# Altium schematic sheet PIC24.SchDoc
size A
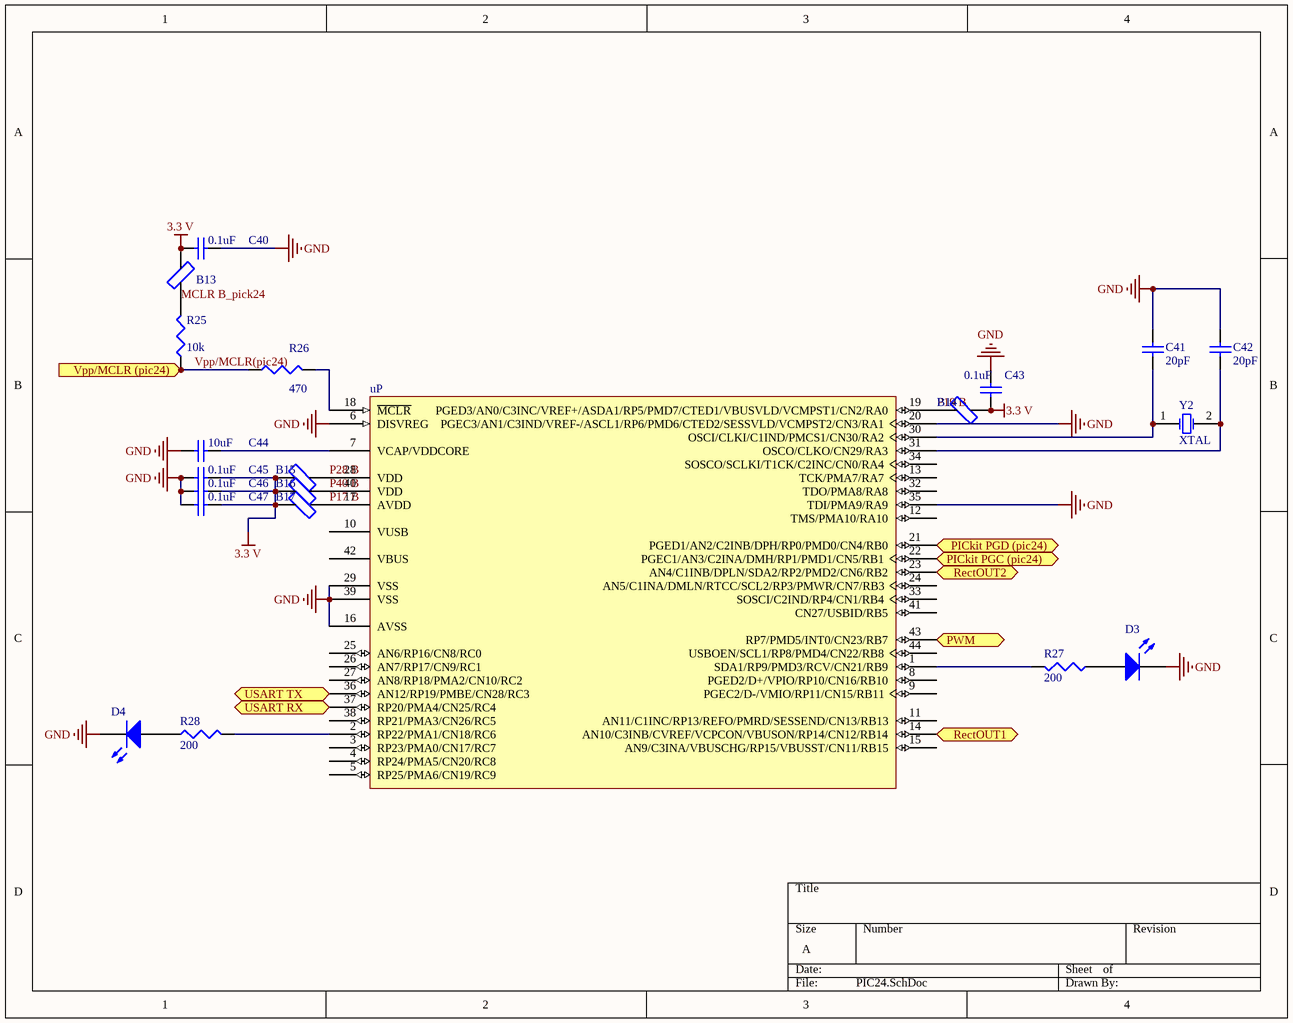
[diagram p0: PIC24.SchDoc]

## Parts
B13  Ferrite Bead  [Resistor 0603]  (value not drawn)
B14  Ferrite Bead  [Resistor 0603]  (value not drawn)
B15  Ferrite Bead  [Resistor 0603]  (value not drawn)
B16  Ferrite Bead  [Resistor 0603]  (value not drawn)
B17  Ferrite Bead  [Resistor 0603]  (value not drawn)
C40  value 0.1uF  [C1206]  (hidden comment: 0.1uF 20V Ceramic Low ESR)
C41  20pF  [Capacitor 0603]
C42  20pF  [Capacitor 0603]
C43  value 0.1uF  [C1206]  (hidden comment: 0.1uF 20V Ceramic Low ESR)
C44  value 10uF  [Capacitor 0603]  (hidden comment: 10uF 6.3V Ceramic or Tantalum Low ESR ~5 Ohm)
C45  value 0.1uF  [C1206]  (hidden comment: 0.1uF 20V Ceramic Low ESR)
C46  value 0.1uF  [C1206]  (hidden comment: 0.1uF 20V Ceramic Low ESR)
C47  value 0.1uF  [C1206]  (hidden comment: 0.1uF 20V Ceramic Low ESR)
D3  LED2  [Resistor 0603]  (value not drawn)
D4  LED2  [Resistor 0603]  (value not drawn)
R25  value 10k  [Capacitor 0603]  (hidden comment: 1/16 w 10K ohms 1%)
R26  470  [Capacitor 0603]
R27  value 200  [Capacitor 0603]  (hidden comment: 200 ohms 1%)
R28  value 200  [Capacitor 0603]  (hidden comment: 200 ohms 1%)
uP  PIC24FJ32GB004-I/PT  [TQFP-PT44_L]  (value not drawn)
Y2  XTAL  [SMD Oscillator]

## Ports
PICkit PGC (pic24) (in), PICkit PGD (pic24) (in), PWM (out), RectOUT1 (in), RectOUT2 (in), USART RX (in), USART TX (out), Vpp/MCLR (pic24) (in)

## Nets
3.3 V: B13.2 B14.2 B15.1 B16.1 B17.1 C40.2 C43.2 C45.1 C46.1 C47.1
GND: C40.1 C41.1 C42.1 C43.1 C44.2 C45.2 C46.2 C47.2 D3.2(K) D4.2(K) uP.6(DISVREG) uP.16(AVSS) uP.20(PGEC3/AN1/C3IND/VREF-/ASCL1/RP6/PMD6/CTED2/SESSVLD/VCMPST2/CN3/RA1) uP.29(VSS) uP.35(TDI/PMA9/RA9) uP.39(VSS)
MCLR B_pick24: B13.1 R25.2
P17 B: B17.2 uP.17(AVDD)
P19 B: B14.1 uP.19(PGED3/AN0/C3INC/VREF+/ASDA1/RP5/PMD7/CTED1/VBUSVLD/VCMPST1/CN2/RA0)
P28 B: B15.2 uP.28(VDD)
P40 B: B16.2 uP.40(VDD)
PICkit PGC (pic24): uP.22(PGEC1/AN3/C2INA/DMH/RP1/PMD1/CN5/RB1) ; port PICkit PGC (pic24)
PICkit PGD (pic24): uP.21(PGED1/AN2/C2INB/DPH/RP0/PMD0/CN4/RB0) ; port PICkit PGD (pic24)
PWM: uP.43(RP7/PMD5/INT0/CN23/RB7) ; port PWM
RectOUT1: uP.14(AN10/C3INB/CVREF/VCPCON/VBUSON/RP14/CN12/RB14) ; port RectOUT1
RectOUT2: uP.23(AN4/C1INB/DPLN/SDA2/RP2/PMD2/CN6/RB2) ; port RectOUT2
USART RX: uP.37(RP20/PMA4/CN25/RC4) ; port USART RX
USART TX: uP.36(AN12/RP19/PMBE/CN28/RC3) ; port USART TX
Vpp/MCLR(pic24): R25.1 R26.1 ; port Vpp/MCLR (pic24)
NetC41_2: C41.2 uP.30(OSCI/CLKI/C1IND/PMCS1/CN30/RA2) Y2.1(OSC1)
NetC42_2: C42.2 uP.31(OSCO/CLKO/CN29/RA3) Y2.2(OSC2)
NetC44_1: C44.1 uP.7(VCAP/VDDCORE)
NetD3_1: D3.1(A) R27.1
NetD4_1: D4.1(A) R28.1
NetR26_2: R26.2 uP.18(~{MCLR})
NetR27_2: R27.2 uP.1(SDA1/RP9/PMD3/RCV/CN21/RB9)
NetR28_2: R28.2 uP.2(RP22/PMA1/CN18/RC6)

Not connected (* = marked no-connect by the designer): uP 3(RP23/PMA0/CN17/RC7) 4(RP24/PMA5/CN20/RC8) 5(RP25/PMA6/CN19/RC9) 8(PGED2/D+/VPIO/RP10/CN16/RB10) 9(PGEC2/D-/VMIO/RP11/CN15/RB11) 10(VUSB) 11(AN11/C1INC/RP13/REFO/PMRD/SESSEND/CN13/RB13) 12(TMS/PMA10/RA10) 13(TCK/PMA7/RA7) 15(AN9/C3INA/VBUSCHG/RP15/VBUSST/CN11/RB15) 24(AN5/C1INA/DMLN/RTCC/SCL2/RP3/PMWR/CN7/RB3) 25(AN6/RP16/CN8/RC0) 26(AN7/RP17/CN9/RC1) 27(AN8/RP18/PMA2/CN10/RC2) 32(TDO/PMA8/RA8) 33(SOSCI/C2IND/RP4/CN1/RB4) 34(SOSCO/SCLKI/T1CK/C2INC/CN0/RA4) 38(RP21/PMA3/CN26/RC5) 41(CN27/USBID/RB5) 42(VBUS) 44(USBOEN/SCL1/RP8/PMD4/CN22/RB8)

## Library data of the parts
B13-B17 = Ferrite Bead: Ferrite Bead: 200 Ohm @ 25 Mhz
C40-C47 = Cap Semi: Capacitor (Semiconductor SIM Model); Published: 8-Jun-2000; LatestRevisionDate: 29-May-2009; LatestRevisionNote: IPC-7351 Footprint Added.; PackageReference: C1206; Publisher: Altium Limited; PackageDescription: Chip Capacitor
  C41 C42: Value: 20pF
D3 D4 = LED2: Typical RED, GREEN, YELLOW, AMBER GaAs LED; Published: 8-Jun-2000; LatestRevisionDate: 17-Jul-2002; LatestRevisionNote: Re-released for DXP Platform.; PackageVersion: Feb-2002; PackageReference: 3.2X1.6X1.1; Publisher: Altium Limited; PackageDescription: SM LED; 2 Flat Leads
R25-R28 = Res3: Resistor; Published: 8-Jun-2000; LatestRevisionDate: 29-May-2009; LatestRevisionNote: IPC-7351 Footprint Added.; PackageReference: J1-0603; Publisher: Altium Limited; PackageDescription: Chip Resistor
  R26: Value: 470
uP = PIC24FJ32GB004-I/PT: 16-Bit Flash Microcontroller with USB On-The-Go and nanoWatt XLP, 32KB Flash, 8KB SRAM, 44-Pin TQFP, Industrial Temperature; Published: 2-Dec-2009; LatestRevisionDate: 07-Oct-2010; LatestRevisionNote: Updated to datasheet revision D, Aug-2010. Supplier links updated.; DatasheetVersion: revD, Aug-2010; PackageVersion: revBB, Aug-2009; PackageReference: TQFP-PT44; Publisher: Altium Limited; PackageDescription: 44-Lead Plastic Thin Quad Flatpack (PT) - 10x10x1mm Body, 2.00mm [TQFP]; Supplier 1: Digi-Key; Supplier Part Number 1: PIC24FJ32GB004-I/PT-ND; Code_JEDEC: MS-026; ComponentLink1Description: Datasheet; ComponentLink1URL: http://ww1.microchip.com/downloads/en/DeviceDoc/39940d.pdf; ComponentLink2Description: Packaging Specification; ComponentLink2URL: http://www.microchip.com/stellent/groups/techpub_sg/documents/packagingspec/en012702.pdf; ComponentLink3Description: Microchip.com Home; ComponentLink3URL: http://www.microchip.com/
Y2 = XTAL: Crystal Oscillator; Published: 8-Jun-2000; LatestRevisionDate: 17-Jul-2002; LatestRevisionNote: Re-released for DXP Platform.; PackageReference: R38; Publisher: Altium Limited; PackageDescription: Crystal, Thru-Hole; 2 Leads; Body 3.1 x 8.2 mm (Dia.xH)